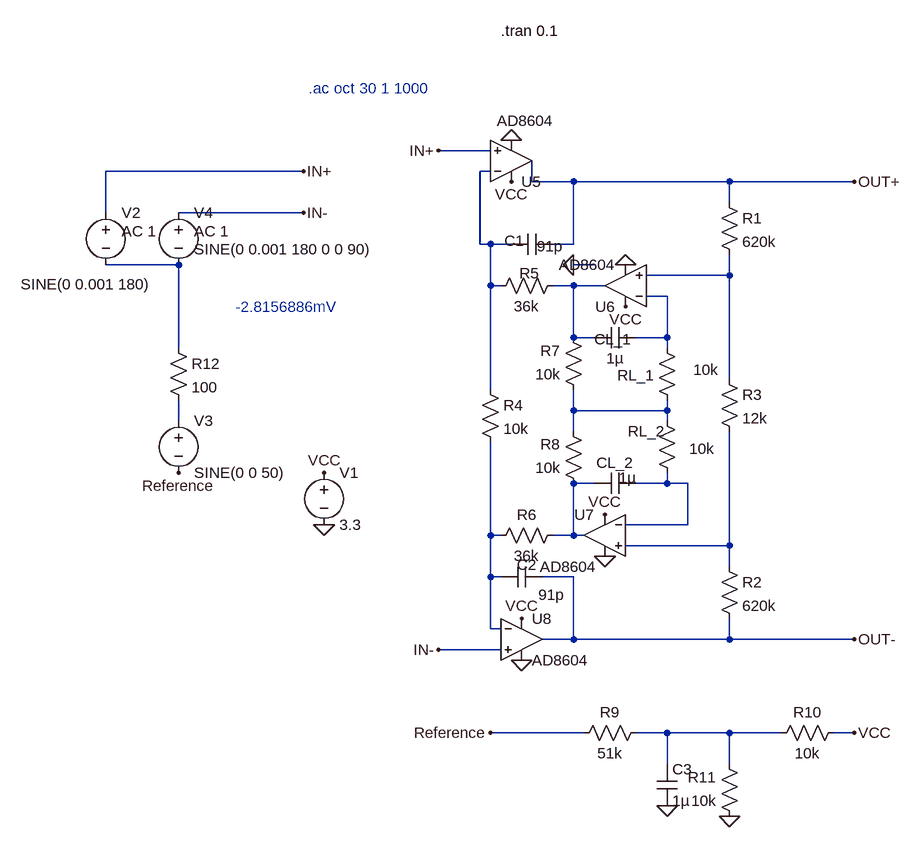
[diagram p0: schematic FDA_AD8604_transient.asc]
FDA_AD8604_transient.asc, the LTspice schematic file:
Version 4
SHEET 1 1520 820
WIRE 336 -224 256 -224
WIRE 48 -192 -256 -192
WIRE 336 -192 320 -192
WIRE 400 -176 400 -208
WIRE 464 -176 400 -176
WIRE 704 -176 464 -176
WIRE 896 -176 704 -176
WIRE 704 -144 704 -176
WIRE -256 -128 -256 -192
WIRE 48 -128 -144 -128
WIRE 320 -80 320 -192
WIRE 336 -80 320 -80
WIRE 368 -80 336 -80
WIRE 464 -80 464 -176
WIRE 464 -80 432 -80
WIRE -144 -48 -256 -48
WIRE 496 -48 464 -48
WIRE 704 -32 704 -64
WIRE 704 -32 576 -32
WIRE 336 -16 336 -80
WIRE 352 -16 336 -16
WIRE 464 -16 432 -16
WIRE 512 -16 464 -16
WIRE 608 0 576 0
WIRE 464 64 464 -16
WIRE 496 64 464 64
WIRE 608 64 608 0
WIRE 608 64 560 64
WIRE -144 80 -144 -48
WIRE 608 80 608 64
WIRE 704 128 704 -32
WIRE 336 144 336 -16
WIRE 464 176 464 144
WIRE 608 176 608 160
WIRE 608 176 464 176
WIRE -144 192 -144 160
WIRE 608 192 608 176
WIRE 464 208 464 176
WIRE 496 288 464 288
WIRE 608 288 608 272
WIRE 608 288 560 288
WIRE 640 288 608 288
WIRE 640 352 640 288
WIRE 640 352 544 352
WIRE 336 368 336 224
WIRE 352 368 336 368
WIRE 464 368 464 288
WIRE 464 368 432 368
WIRE 480 368 464 368
WIRE 704 384 704 208
WIRE 704 384 544 384
WIRE 704 416 704 384
WIRE 336 432 336 368
WIRE 352 432 336 432
WIRE 464 432 416 432
WIRE 336 512 336 432
WIRE 352 512 336 512
WIRE 464 528 464 432
WIRE 464 528 416 528
WIRE 704 528 704 496
WIRE 704 528 464 528
WIRE 896 528 704 528
WIRE 352 544 256 544
WIRE 480 672 336 672
WIRE 608 672 560 672
WIRE 704 672 608 672
WIRE 784 672 704 672
WIRE 896 672 864 672
WIRE 608 720 608 672
WIRE 704 720 704 672
FLAG 896 -176 OUT+
FLAG 896 528 OUT-
FLAG 256 -224 IN+
FLAG 256 544 IN-
FLAG 48 -192 IN+
FLAG 80 352 0
FLAG 80 272 VCC
FLAG 464 -48 0
FLAG 368 -176 VCC
FLAG 384 496 VCC
FLAG 384 560 0
FLAG 368 -240 0
FLAG 336 672 Reference
FLAG 608 784 0
FLAG 704 800 0
FLAG 896 672 VCC
FLAG 48 -128 IN-
FLAG -144 272 Reference
FLAG 544 -48 0
FLAG 544 16 VCC
FLAG 512 400 0
FLAG 512 336 VCC
SYMBOL cap 432 -96 R90
WINDOW 0 26 59 VBottom 2
WINDOW 3 4 4 VTop 2
SYMATTR InstName C1
SYMATTR Value 91p
SYMBOL cap 416 416 R90
WINDOW 0 13 24 VBottom 2
WINDOW 3 28 -14 VTop 2
SYMATTR InstName C2
SYMATTR Value 91p
SYMBOL cap 560 48 R90
WINDOW 0 34 35 VBottom 2
WINDOW 3 32 32 VTop 2
SYMATTR InstName CL_1
SYMATTR Value 1µ
SYMBOL cap 560 272 R90
WINDOW 0 0 32 VBottom 2
WINDOW 3 -8 13 VTop 2
SYMATTR InstName CL_2
SYMATTR Value 1µ
SYMBOL res 688 -160 R0
SYMATTR InstName R1
SYMATTR Value 620k
SYMBOL res 688 400 R0
SYMATTR InstName R2
SYMATTR Value 620k
SYMBOL res 688 112 R0
SYMATTR InstName R3
SYMATTR Value 12k
SYMBOL res 320 128 R0
SYMATTR InstName R4
SYMATTR Value 10k
SYMBOL res 448 -32 R90
WINDOW 0 12 52 VBottom 2
WINDOW 3 32 56 VTop 2
SYMATTR InstName R5
SYMATTR Value 36k
SYMBOL res 448 352 R90
WINDOW 0 0 56 VBottom 2
WINDOW 3 32 56 VTop 2
SYMATTR InstName R6
SYMATTR Value 36k
SYMBOL res 624 176 R180
WINDOW 0 35 54 Left 2
WINDOW 3 -63 63 Left 2
SYMATTR InstName RL_1
SYMATTR Value 10k
SYMBOL res 480 160 R180
WINDOW 0 36 76 Left 2
WINDOW 3 36 40 Left 2
SYMATTR InstName R7
SYMATTR Value 10k
SYMBOL res 480 304 R180
WINDOW 0 36 76 Left 2
WINDOW 3 36 40 Left 2
SYMATTR InstName R8
SYMATTR Value 10k
SYMBOL res 624 288 R180
WINDOW 0 19 80 Left 2
WINDOW 3 -57 53 Left 2
SYMATTR InstName RL_2
SYMATTR Value 10k
SYMBOL voltage 80 256 R0
WINDOW 123 0 0 Left 0
WINDOW 39 0 0 Left 0
SYMATTR InstName V1
SYMATTR Value 3.3
SYMBOL res 576 656 R90
WINDOW 0 0 56 VBottom 2
WINDOW 3 32 56 VTop 2
SYMATTR InstName R9
SYMATTR Value 51k
SYMBOL res 880 656 R90
WINDOW 0 0 56 VBottom 2
WINDOW 3 32 56 VTop 2
SYMATTR InstName R10
SYMATTR Value 10k
SYMBOL res 720 816 R180
WINDOW 0 36 76 Left 2
WINDOW 3 36 40 Left 2
SYMATTR InstName R11
SYMATTR Value 10k
SYMBOL cap 592 720 R0
SYMATTR InstName C3
SYMATTR Value 1µ
SYMBOL voltage -256 -144 R0
WINDOW 123 24 44 Left 2
WINDOW 39 0 0 Left 0
WINDOW 3 -131 126 Left 2
SYMATTR Value2 AC 1
SYMATTR Value SINE(0 0.001 180)
SYMATTR InstName V2
SYMBOL res -160 64 R0
SYMATTR InstName R12
SYMATTR Value 100
SYMBOL voltage -144 176 R0
WINDOW 123 0 0 Left 0
WINDOW 39 0 0 Left 0
SYMATTR InstName V3
SYMATTR Value SINE(0 0 50)
SYMBOL OpAmps\\AD8604 368 -144 M180
WINDOW 3 -22 126 Left 2
SYMATTR InstName U5
SYMBOL OpAmps\\AD8604 544 48 R180
SYMATTR InstName U6
SYMBOL OpAmps\\AD8604 512 304 M0
WINDOW 3 13 112 Left 2
SYMATTR InstName U7
SYMBOL OpAmps\\AD8604 384 464 R0
SYMATTR InstName U8
SYMBOL voltage -144 -144 R0
WINDOW 123 24 44 Left 2
WINDOW 39 0 0 Left 0
WINDOW 3 24 72 Left 2
SYMATTR Value2 AC 1
SYMATTR Value SINE(0 0.001 180 0 0 90)
SYMATTR InstName V4
TEXT 56 -320 Left 2 ;.ac oct 30 1 1000
TEXT 352 -408 Left 2 !.tran 0.1
TEXT -56 16 Left 2 ;-2.8156886mV

The netlist it stands for:
* FDA_AD8604_transient.asc
C1 OUT+ N001 91p
C2 OUT- N010 91p
CL_1 N005 N004 1µ
CL_2 N009 N008 1µ
R1 OUT+ N003 620k
R2 N011 OUT- 620k
R3 N003 N011 12k
R4 N001 N010 10k
R5 N004 N001 36k
R6 N008 N010 36k
RL_1 N006 N005 10k
R7 N006 N004 10k
R8 N008 N006 10k
RL_2 N009 N006 10k
V1 VCC 0 3.3
R9 N012 Reference 51k
R10 VCC N012 10k
R11 0 N012 10k
C3 N012 0 1µ
V2 IN+ N002 SINE(0 0.001 180) AC 1
R12 N002 N007 100
V3 N007 Reference SINE(0 0 50)
XU5 IN+ N001 VCC 0 OUT+ AD8604  ; pins In+ In- V+ V- OUT
XU6 N003 N005 VCC 0 N004 AD8604  ; pins In+ In- V+ V- OUT
XU7 N011 N009 VCC 0 N008 AD8604  ; pins In+ In- V+ V- OUT
XU8 IN- N010 VCC 0 OUT- AD8604  ; pins In+ In- V+ V- OUT
V4 IN- N002 SINE(0 0.001 180 0 0 90) AC 1
* .ac oct 30 1 1000
.tran 0.1
* -2.8156886mV
.backanno
.end